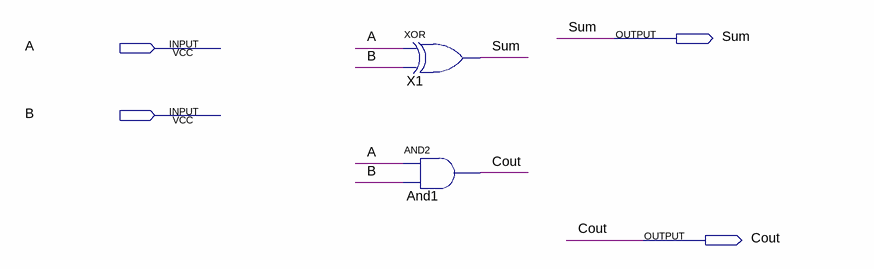
[diagram p0: schematic sheet]
// Quartus schematic Q1.bdf as structural Verilog: 2 symbols, 4 pins
module Q1 (
  input  A,
  input  B,
  output Sum,
  output Cout
);

  xor X1 (Sum, A, B);
  and And1 (Cout, A, B);
endmodule
